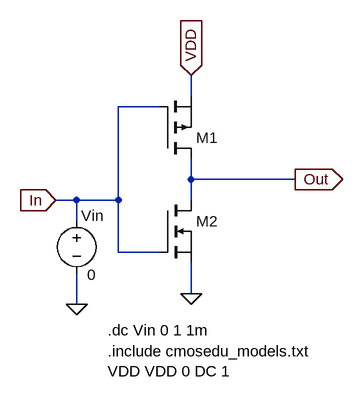
[diagram p0: schematic Inverter_Sim.asc]
Inverter_Sim.asc, the LTspice schematic file:
Version 4
SHEET 1 1024 680
WIRE 128 -672 128 -704
WIRE 80 -656 16 -656
WIRE 128 -544 128 -576
WIRE 288 -544 128 -544
WIRE -48 -512 -80 -512
WIRE 16 -512 16 -656
WIRE 16 -512 -48 -512
WIRE 128 -512 128 -544
WIRE -48 -480 -48 -512
WIRE 16 -432 16 -512
WIRE 80 -432 16 -432
WIRE 128 -368 128 -416
WIRE -48 -352 -48 -400
FLAG 128 -368 0
FLAG 288 -544 Out
IOPIN 288 -544 Out
FLAG 128 -704 VDD
IOPIN 128 -704 In
FLAG -80 -512 In
IOPIN -80 -512 In
FLAG -48 -352 0
SYMBOL nmos 80 -512 R0
WINDOW 3 56 72 Invisible 2
SYMATTR Value N_50n
SYMATTR InstName M2
SYMBOL pmos 80 -576 M180
WINDOW 3 56 72 Invisible 2
SYMATTR Value P_50n
SYMATTR InstName M1
SYMBOL voltage -48 -496 R0
WINDOW 0 7 8 Left 2
WINDOW 3 16 99 Left 2
SYMATTR InstName Vin
SYMATTR Value 0
TEXT 0 -312 Left 2 !.dc Vin 0 1 1m
TEXT 0 -280 Left 2 !.include cmosedu_models.txt\nVDD VDD 0 DC 1

The netlist it stands for:
* Inverter_Sim.asc
M2 Out In 0 0 N_50n
M1 Out In VDD VDD P_50n
Vin In 0 0
.model NMOS NMOS
.model PMOS PMOS
.lib standard.mos
.dc Vin 0 1 1m
.include cmosedu_models.txt
VDD VDD 0 DC 1
.backanno
.end